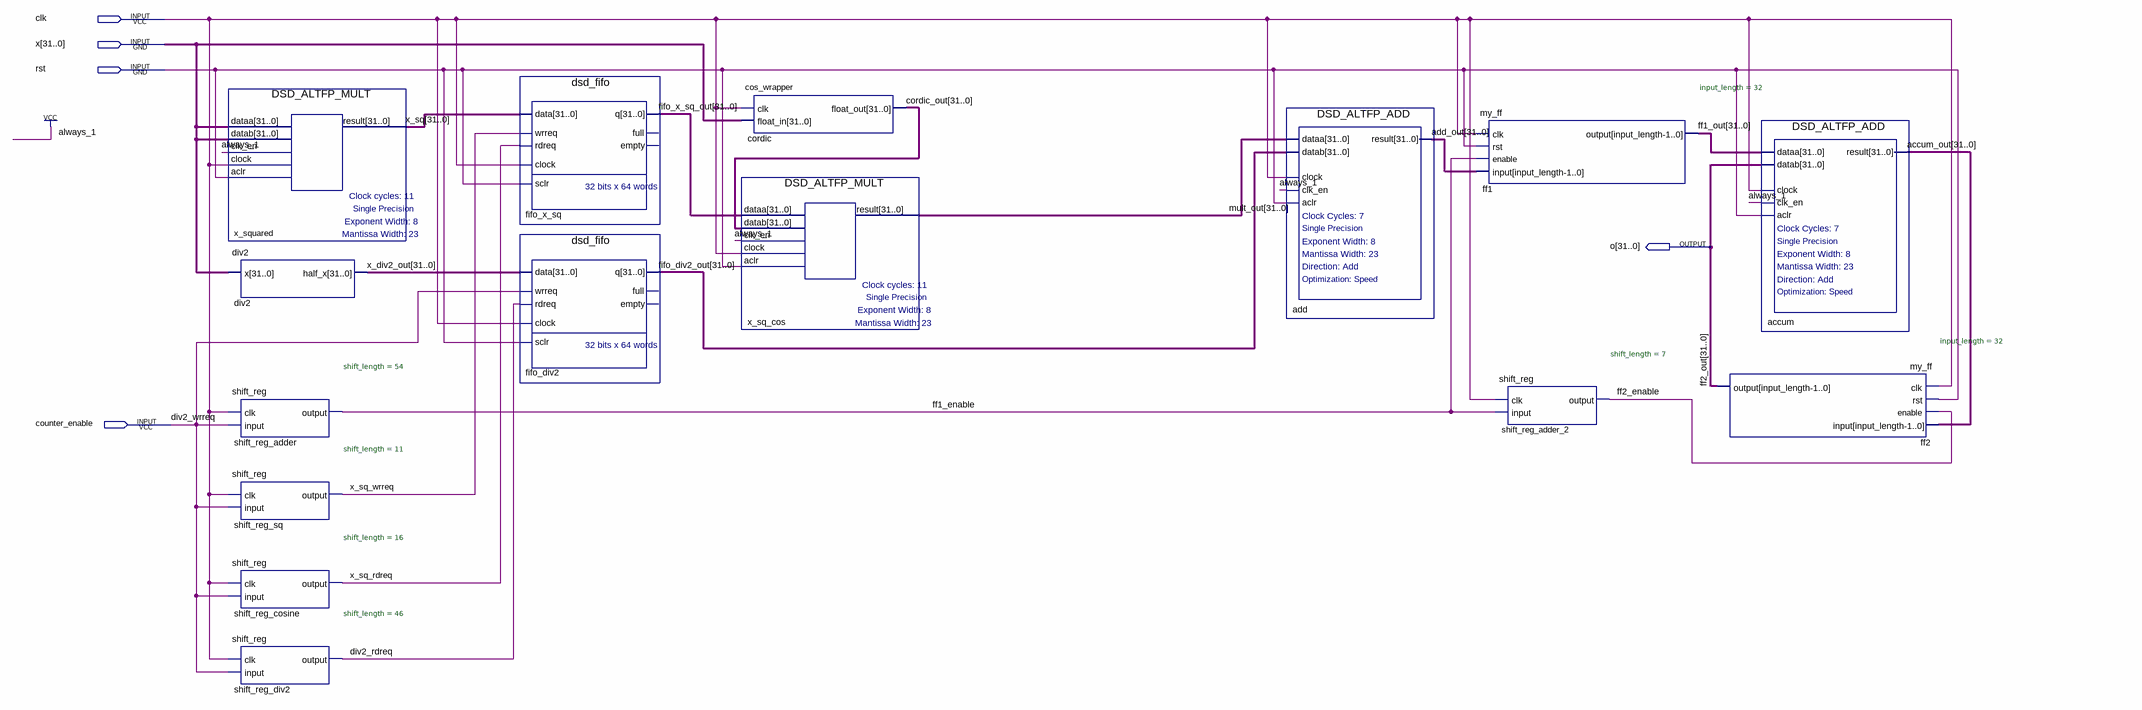
[diagram p0: schematic sheet]
// Quartus schematic pipe.bdf as structural Verilog: 15 symbols, 5 pins
module pipe (
  input  clk,
  input  [31:0] x,
  input  rst,
  input  counter_enable,
  output [31:0] o
);

  wire div2_rdreq, ff1_enable, ff2_enable, x_sq_rdreq, x_sq_wrreq;
  wire [31:0] accum_out, add_out, cordic_out, ff1_out, fifo_div2_out, fifo_x_sq_out, mult_out, x_div2_out,
       x_sq;

  DSD_ALTFP_MULT x_squared (.dataa(x), .datab(x), .clk_en(1'b1), .clock(clk), .aclr(rst), .result(x_sq));
  div2 div2 (.x(x), .half_x(x_div2_out));
  shift_reg #(.shift_length(54)) shift_reg_adder (.clk(clk), .\input (counter_enable), .\output (ff1_enable));
  shift_reg #(.shift_length(11)) shift_reg_sq (.clk(clk), .\input (counter_enable), .\output (x_sq_wrreq));
  shift_reg #(.shift_length(16)) shift_reg_cosine (.clk(clk), .\input (counter_enable), .\output (x_sq_rdreq));
  shift_reg #(.shift_length(46)) shift_reg_div2 (.clk(clk), .\input (counter_enable), .\output (div2_rdreq));
  dsd_fifo fifo_x_sq (
    .data(x_sq), .wrreq(x_sq_wrreq), .rdreq(x_sq_rdreq), .clock(clk), .sclr(rst), .q(fifo_x_sq_out));  // open: full, empty
  dsd_fifo fifo_div2 (
    .data(x_div2_out), .wrreq(counter_enable), .rdreq(div2_rdreq), .clock(clk), .sclr(rst), .q(fifo_div2_out));  // open: full, empty
  cos_wrapper cordic (.clk(clk), .float_in(x), .float_out(cordic_out));
  DSD_ALTFP_MULT x_sq_cos (
    .dataa(fifo_x_sq_out), .datab(cordic_out), .clk_en(1'b1), .clock(clk), .aclr(rst), .result(mult_out));
  DSD_ALTFP_ADD add (.dataa(mult_out), .datab(fifo_div2_out), .clock(clk), .clk_en(1'b1), .aclr(rst), .result(add_out));
  my_ff #(.input_length(32)) ff1 (.clk(clk), .rst(rst), .enable(ff1_enable), .\input (add_out), .\output (ff1_out));
  shift_reg #(.shift_length(7)) shift_reg_adder_2 (.clk(clk), .\input (ff1_enable), .\output (ff2_enable));
  my_ff #(.input_length(32)) ff2 (.clk(clk), .rst(rst), .enable(ff2_enable), .\input (accum_out), .\output (o));
  DSD_ALTFP_ADD accum (.dataa(ff1_out), .datab(o), .clock(clk), .clk_en(1'b1), .aclr(rst), .result(accum_out));

  // Other names for the same wires on the sheet: div2_wrreq = counter_enable; ff2_out[31:0] = o
endmodule
